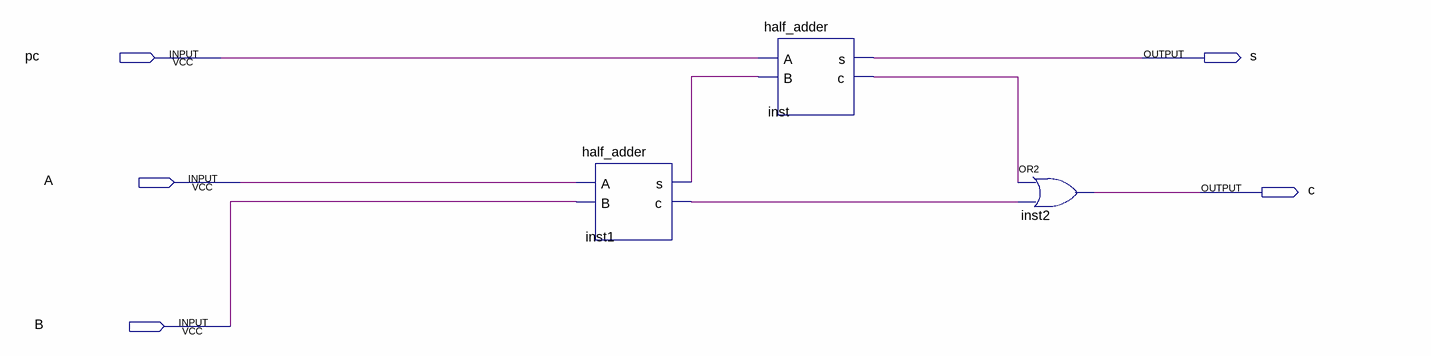
[diagram p0: schematic sheet]
// Quartus schematic full_adder.bdf as structural Verilog: 3 symbols, 5 pins
module full_adder (
  input  pc,
  input  A,
  input  B,
  output s,
  output c
);

  wire inst1_c, inst1_s, inst_c;

  half_adder inst1 (.A(A), .B(B), .s(inst1_s), .c(inst1_c));
  half_adder inst (.A(pc), .B(inst1_s), .s(s), .c(inst_c));
  or inst2 (c, inst_c, inst1_c);
endmodule
